# Altium schematic sheet [2]-Power Budget.SchDoc
size A4
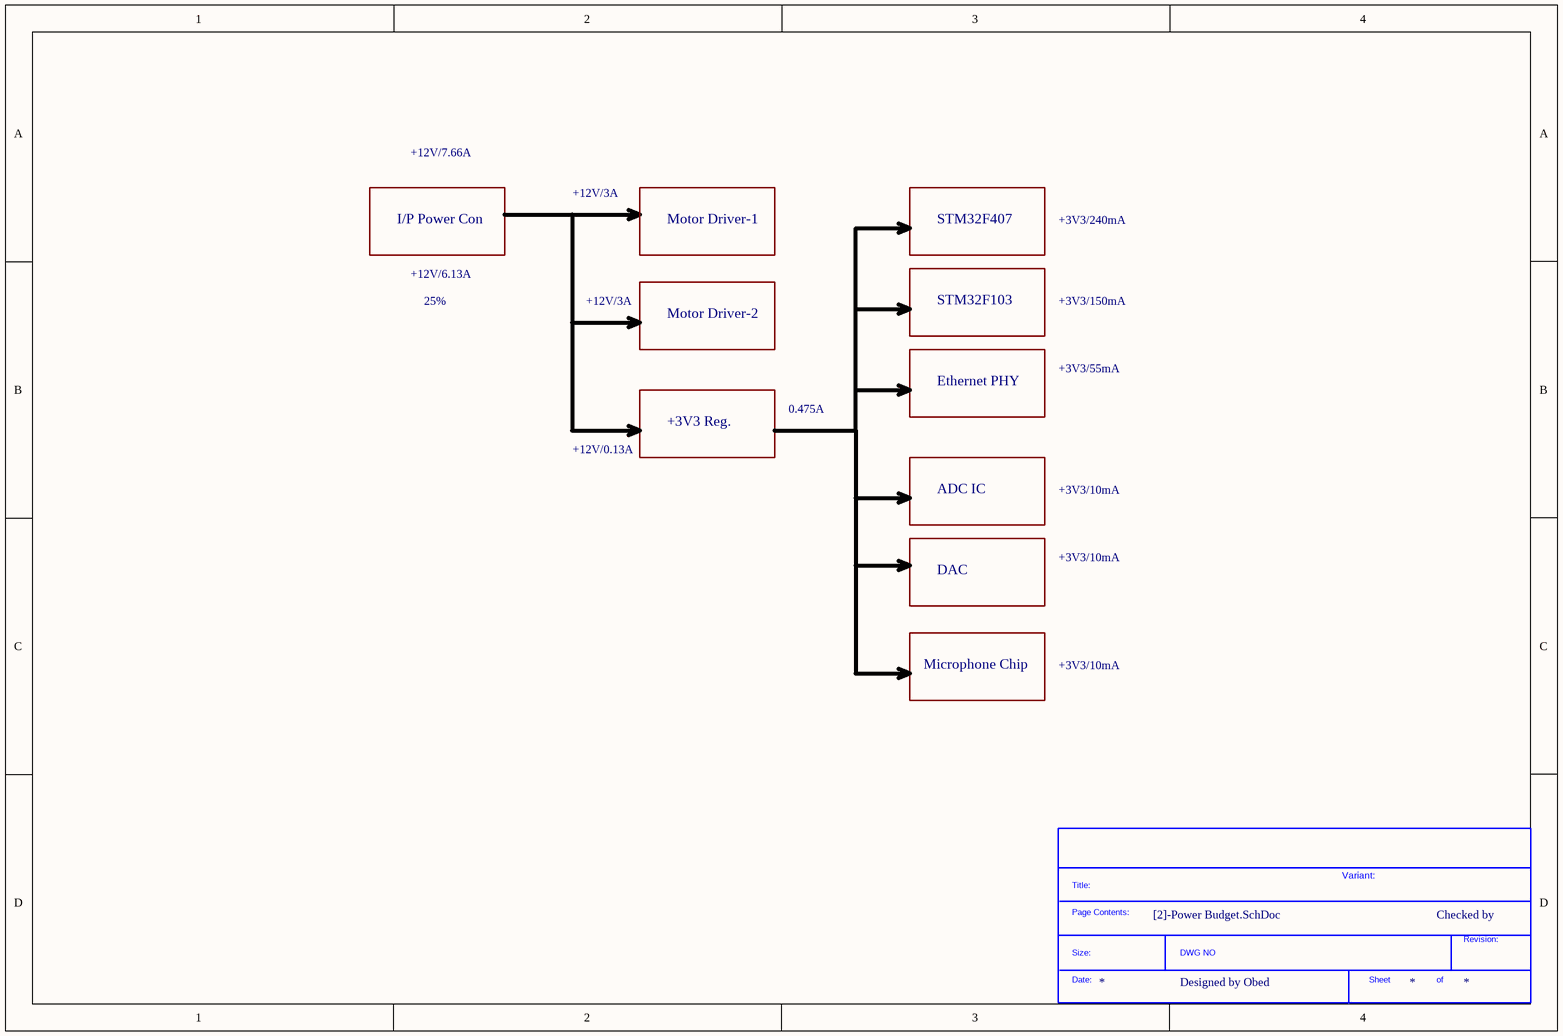
[diagram p0: [2]-Power Budget.SchDoc]

## Parts
*?  SDTitleBlock  (value not drawn)  (graphical)

## Notes on the sheet
- +12V/7.66A
- I/P Power Con
- +12V/3A
- Motor Driver-1
- STM32F407
- +3V3/240mA
- +12V/6.13A
- 25%
- STM32F103
- +3V3/150mA
- Motor Driver-2
- Ethernet PHY
- +3V3/55mA
- +3V3 Reg.
- 0.475A
- +12V/0.13A
- ADC IC
- +3V3/10mA
- DAC
- Microphone Chip
- Variant:
- Checked by
- Designed by Obed
- (in symbol SDTitleBlock) Title:; Page Contents:; Revision:; Size:; DWG NO; Date:; Sheet; of